# Altium schematic sheet 接口.SchDoc
size A4; SheetNumber: 3; SheetTotal: 4
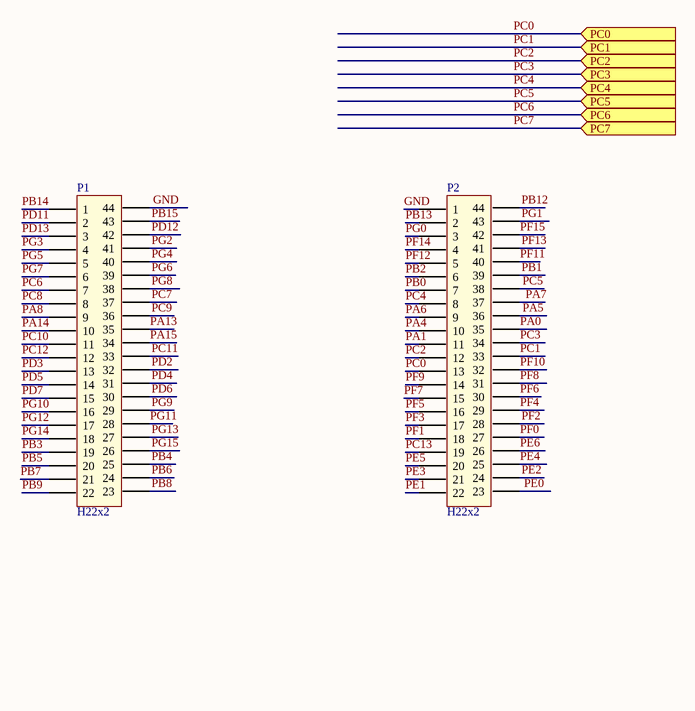
[diagram p0: 接口.SchDoc]

## Parts
P1  H22x2  [HDR2.54-F-44P]
P2  H22x2  [HDR2.54-F-44P]

## Ports
PC0 (in), PC1 (in), PC2 (in), PC3 (in), PC4 (in), PC5 (in), PC6 (in), PC7 (in)

## Nets
GND: P1.44 P2.1
PA0: P2.35
PA1: P2.11
PA4: P2.10
PA5: P2.36
PA6: P2.9
PA7: P2.37
PA8: P1.9
PA13: P1.35
PA14: P1.10
PA15: P1.34
PB0: P2.7
PB1: P2.39
PB2: P2.6
PB3: P1.19
PB4: P1.25
PB5: P1.20
PB6: P1.24
PB7: P1.21
PB8: P1.23
PB9: P1.22
PB12: P2.44
PB13: P2.2
PB14: P1.1
PB15: P1.43
PC0: P2.13 ; port PC0
PC1: P2.33 ; port PC1
PC2: P2.12 ; port PC2
PC3: P2.34 ; port PC3
PC4: P2.8 ; port PC4
PC5: P2.38 ; port PC5
PC6: P1.7 ; port PC6
PC7: P1.37 ; port PC7
PC8: P1.8
PC9: P1.36
PC10: P1.11
PC11: P1.33
PC12: P1.12
PC13: P2.19
PD2: P1.32
PD3: P1.13
PD4: P1.31
PD5: P1.14
PD6: P1.30
PD7: P1.15
PD11: P1.2
PD12: P1.42
PD13: P1.3
PE0: P2.23
PE1: P2.22
PE2: P2.24
PE3: P2.21
PE4: P2.25
PE5: P2.20
PE6: P2.26
PF0: P2.27
PF1: P2.18
PF2: P2.28
PF3: P2.17
PF4: P2.29
PF5: P2.16
PF6: P2.30
PF7: P2.15
PF8: P2.31
PF9: P2.14
PF10: P2.32
PF11: P2.40
PF12: P2.5
PF13: P2.41
PF14: P2.4
PF15: P2.42
PG0: P2.3
PG1: P2.43
PG2: P1.41
PG3: P1.4
PG4: P1.40
PG5: P1.5
PG6: P1.39
PG7: P1.6
PG8: P1.38
PG9: P1.29
PG10: P1.16
PG11: P1.28
PG12: P1.17
PG13: P1.27
PG14: P1.18
PG15: P1.26

## Notes on the sheet
- Text